# EasyEDA Pro project ProPrj_两相交错电源demo_2025-05-26.epro, schematic Schematic1_1
Board Name: Board1; Create Date: 2025-03-06; Page Name: P1; Project Name: 两相交错电源demo; Schematic Name: Schematic1; Update Date: 2025-03-09; Company: 嘉立创EDA; Page Size: A4; Version: V1.0
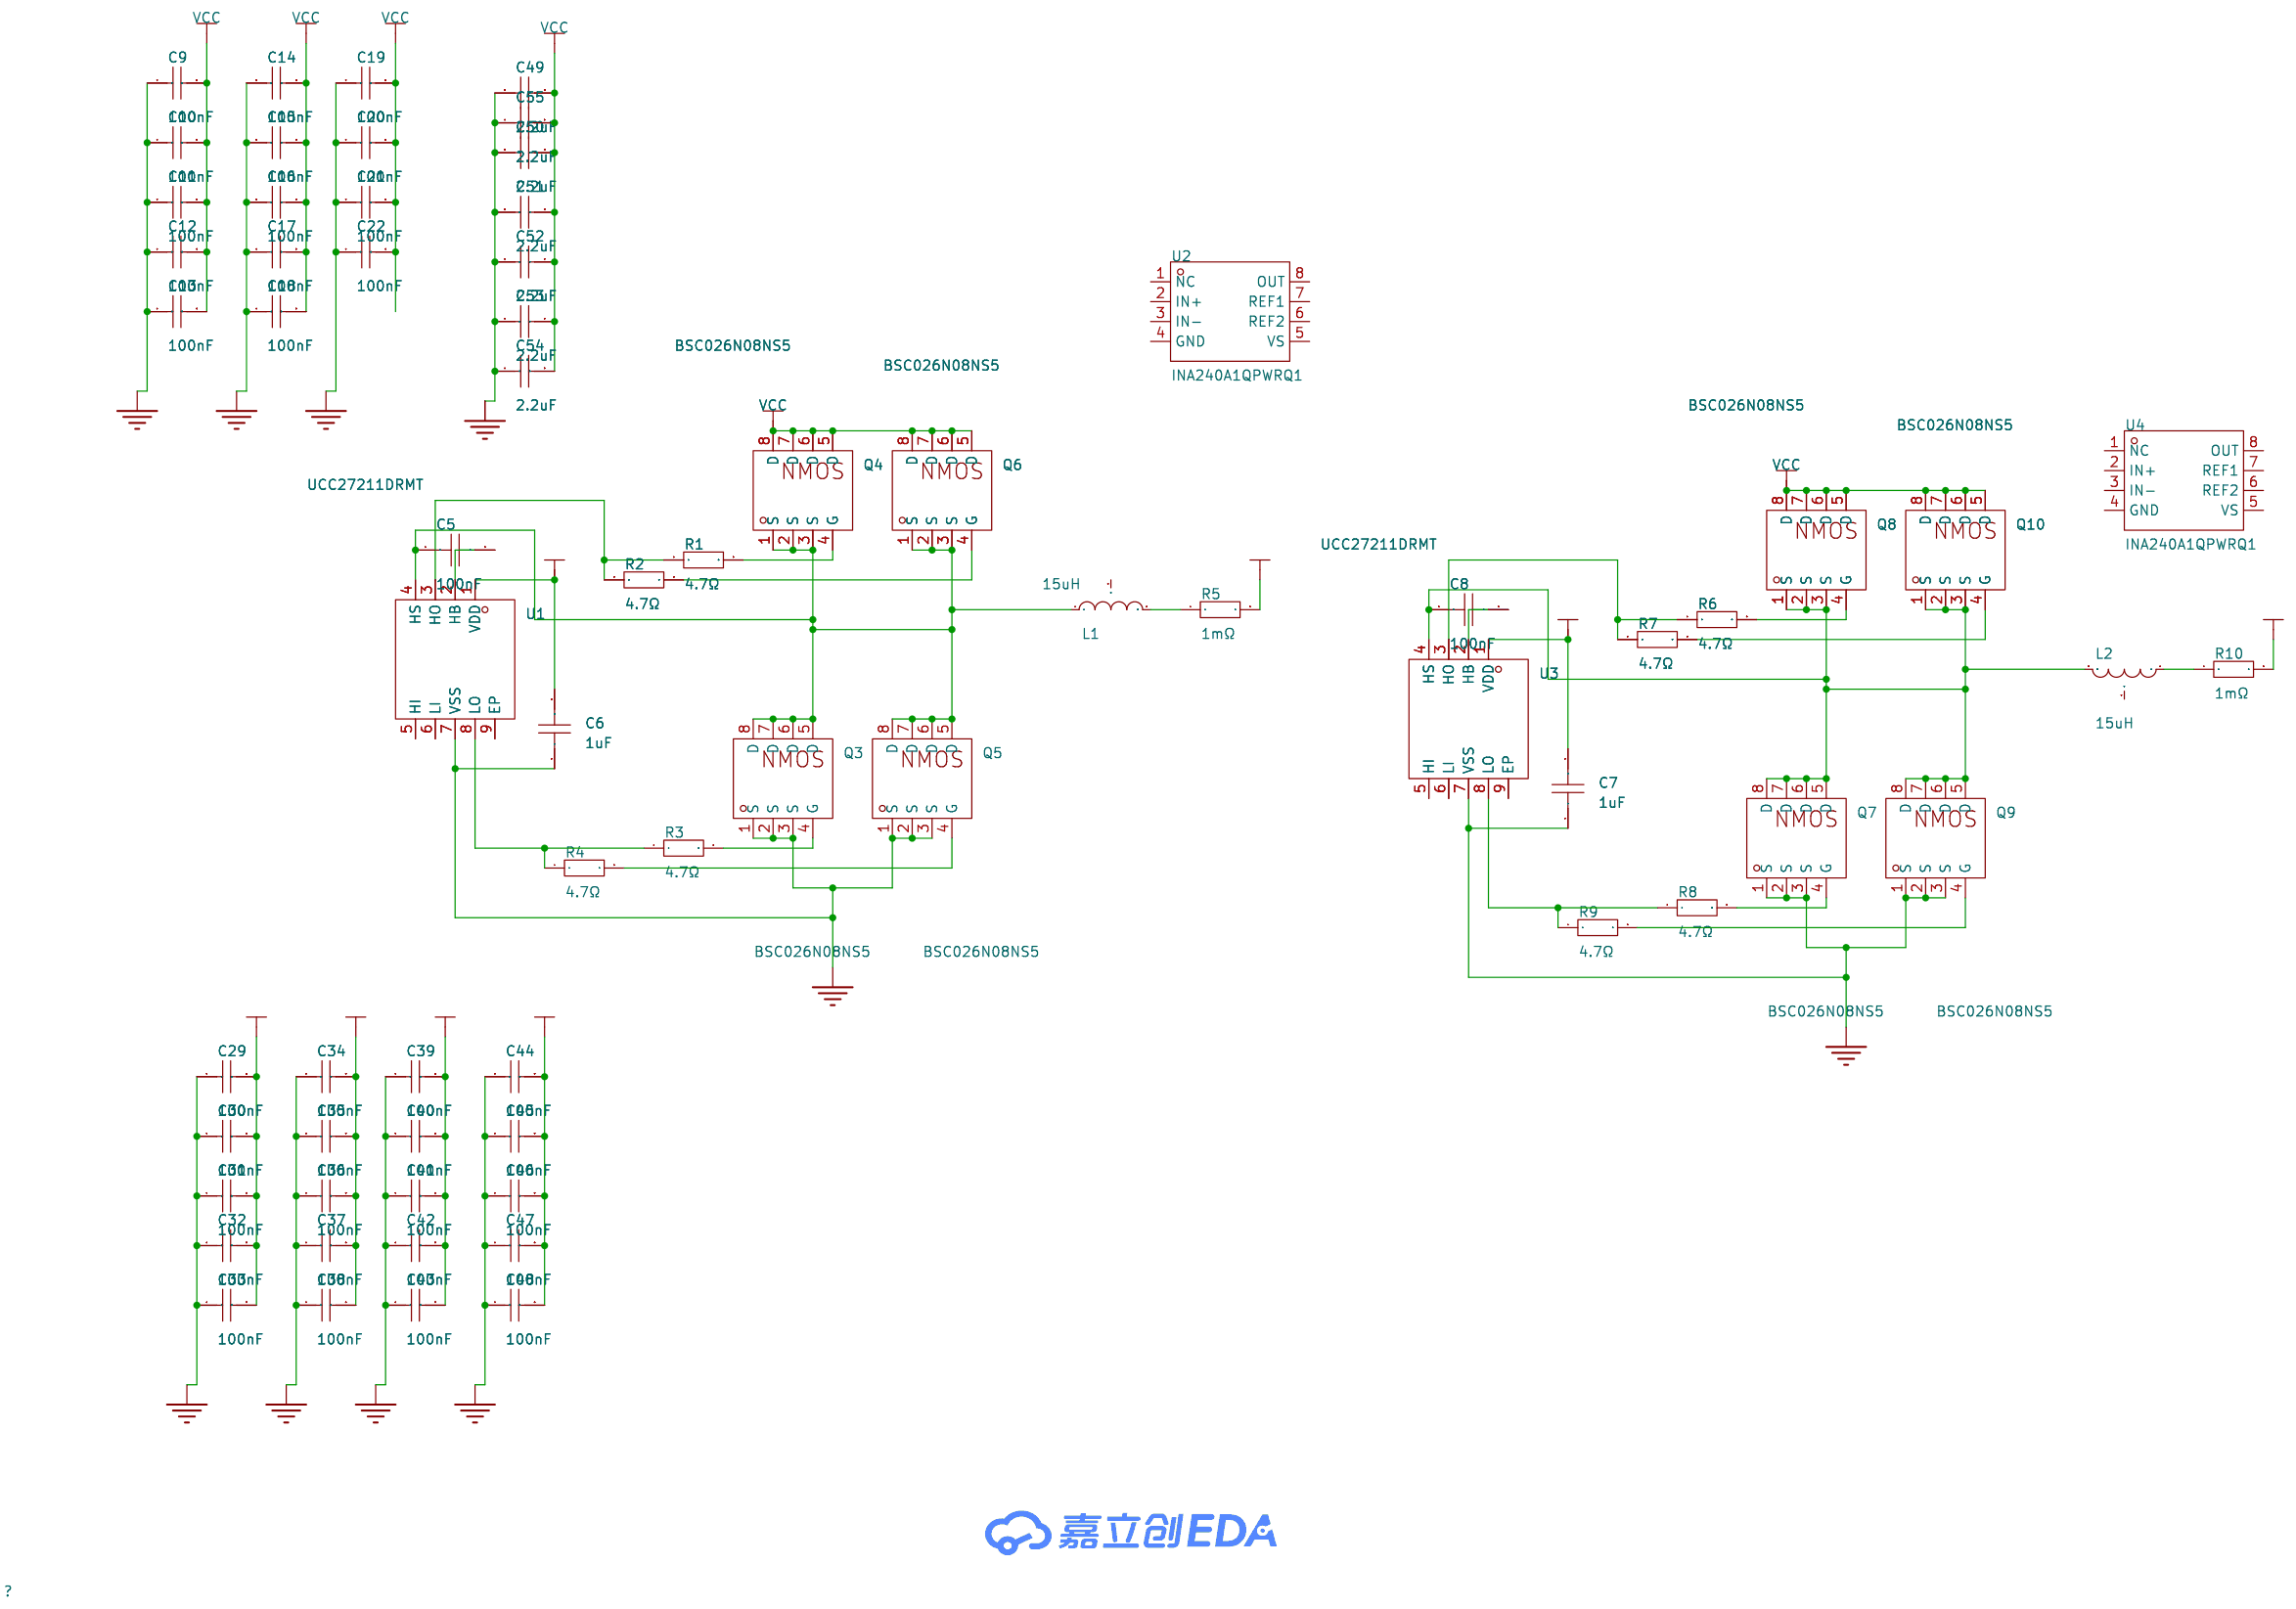
[diagram p3: schematic sheet]

## Parts
C5  100nF  [C0805]
C6  1uF  [C0805]
C7  1uF  [C0805]
C8  100nF  [C0805]
C9  100nF  [C1206]
C10  100nF  [C1206]
C11  100nF  [C1206]
C12  100nF  [C1206]
C13  100nF  [C1206]
C14  100nF  [C1206]
C15  100nF  [C1206]
C16  100nF  [C1206]
C17  100nF  [C1206]
C18  100nF  [C1206]
C19  100nF  [C1206]
C20  100nF  [C1206]
C21  100nF  [C1206]
C22  100nF  [C1206]
C29  100nF  [C1206]
C30  100nF  [C1206]
C31  100nF  [C1206]
C32  100nF  [C1206]
C33  100nF  [C1206]
C34  100nF  [C1206]
C35  100nF  [C1206]
C36  100nF  [C1206]
C37  100nF  [C1206]
C38  100nF  [C1206]
C39  100nF  [C1206]
C40  100nF  [C1206]
C41  100nF  [C1206]
C42  100nF  [C1206]
C43  100nF  [C1206]
C44  100nF  [C1206]
C45  100nF  [C1206]
C46  100nF  [C1206]
C47  100nF  [C1206]
C48  100nF  [C1206]
C49  2.2uF  [C0805]
C50  2.2uF  [C0805]
C51  2.2uF  [C0805]
C52  2.2uF  [C0805]
C53  2.2uF  [C0805]
C54  2.2uF  [C0805]
C55  2.2uF  [C0805]
L1  15uH  [IND-SMD_3P-L28.0-W27.0_1]
L2  15uH  [IND-SMD_3P-L28.0-W27.0_1]
Q3  BSC026N08NS5  [PG-TDSON-8_L5.0-W6.0-P1.27-BL-EP]
Q4  BSC026N08NS5  [PG-TDSON-8_L5.0-W6.0-P1.27-BL-EP]
Q5  BSC026N08NS5  [PG-TDSON-8_L5.0-W6.0-P1.27-BL-EP]
Q6  BSC026N08NS5  [PG-TDSON-8_L5.0-W6.0-P1.27-BL-EP]
Q7  BSC026N08NS5  [PG-TDSON-8_L5.0-W6.0-P1.27-BL-EP]
Q8  BSC026N08NS5  [PG-TDSON-8_L5.0-W6.0-P1.27-BL-EP]
Q9  BSC026N08NS5  [PG-TDSON-8_L5.0-W6.0-P1.27-BL-EP]
Q10  BSC026N08NS5  [PG-TDSON-8_L5.0-W6.0-P1.27-BL-EP]
R1  4.7Ω  [R0805]
R2  4.7Ω  [R0805]
R3  4.7Ω  [R0805]
R4  4.7Ω  [R0805]
R5  1mΩ  [R1206]
R6  4.7Ω  [R0805]
R7  4.7Ω  [R0805]
R8  4.7Ω  [R0805]
R9  4.7Ω  [R0805]
R10  1mΩ  [R1206]
U1  UCC27211DRMT  [VSON-8_L4.0-W4.0-BL-EP]
U2  INA240A1QPWRQ1  [TSSOP-8_L4.4-W3.0-P0.65-LS6.4-BL]
U3  UCC27211DRMT  [VSON-8_L4.0-W4.0-BL-EP]
U4  INA240A1QPWRQ1  [TSSOP-8_L4.4-W3.0-P0.65-LS6.4-BL]

## Library data of the parts
C5-C8 = C0805S102K1RAC7800: 容值:1nF;精度:±10%;额定电压:100V;温度系数:X7R;; LCSC Part Name: 1nF ±10% 100V; Supplier Part: C141167; Manufacturer: KEMET(基美); Supplier Footprint: 0805; Datasheet: https://atta.szlcsc.com/upload/public/pdf/source/20171201/C141167_15121177000921156234.pdf; Supplier: LCSC; Tolerance: ±10%; Voltage Rated: 100V; Temperature Coefficient: X7R
C9-C22 C29-C48 = CL31B104KBCNNNC: 容值:100nF;精度:±10%;额定电压:50V;材质(温度系数):X7R;; LCSC Part Name: 100nF ±10% 50V; Supplier Part: C24497; Manufacturer: SAMSUNG(三星); Supplier Footprint: 1206; JLCPCB Part Class: 基础库; Datasheet: https://atta.szlcsc.com/upload/public/pdf/source/20160218/1457707763339.pdf; Supplier: LCSC; Tolerance: ±10%; Voltage Rated: 50V; Temperature Coefficient: X7R
C49-C55 = CGA0805X7R225K101MT: 容值:2.2uF;精度:±10%;额定电压:100V;材质(温度系数):X7R;; LCSC Part Name: 2.2uF ±10% 100V; Supplier Part: C6119935; Manufacturer: HRE(芯声); Supplier Footprint: 0805; JLCPCB Part Class: Extended Part; Datasheet: https://atta.szlcsc.com/upload/public/pdf/source/20240429/FFBBB2C1A6FCA7F2201C7203CC19BC42.pdf; Supplier: LCSC; Tolerance: ±10%; Voltage Rated: 100V; Temperature Coefficient: X7R
L1 L2 = MTP2920-150MC: 电感值:15uH;精度:±20%;额定电流:20A;饱和电流(Isat):20A;; LCSC Part Name: 15uH ±20% 20A; Supplier Part: C2858867; Manufacturer: COILMX(迈翔科技); Supplier Footprint: SMD,28x27x21.5mm; Supplier: LCSC; Tolerance: ±20%; Rated Current: 20A; Saturation Current (Isat): 20A; DC Resistance (DCR): 2.5mΩ
Q3-Q10 = BSC026N08NS5: 类型:-;漏源电压(Vdss):-;连续漏极电流(Id):-;功率(Pd):-;导通电阻(RDS(on)@Vgs,Id):-;阈值电压(Vgs(th)@Id):-;; Supplier Part: C534311; Manufacturer: Infineon(英飞凌); Supplier Footprint: TDSON-8-EP(5x6); JLCPCB Part Class: 扩展库; Datasheet: https://atta.szlcsc.com/upload/public/pdf/source/20210128/C534311_A26F5C2A3F6ED0B8CFCE9EC3167D41E6.pdf; Supplier: LCSC
R1-R4 R6-R9 = 0805W8F470KT5E: 电阻类型:厚膜电阻;阻值:4.7Ω;精度:±1%;功率:125mW;最大工作电压:150V;温度系数:±200ppm/℃;; LCSC Part Name: 4.7Ω ±1% 125mW 厚膜电阻; Supplier Part: C17675; Manufacturer: UNI-ROYAL(厚声); Supplier Footprint: 0805; JLCPCB Part Class: 基础库; Datasheet: https://atta.szlcsc.com/upload/public/pdf/source/20200306/C422600_1E6D84923E4A46A82E41ADD87F860B5C.pdf; Supplier: LCSC; Type: 厚膜电阻; Tolerance: ±1%; Power(Watts): 125mW; Overload Voltage (Max): 150V; Temperature Coefficient: ±200ppm/℃; Operating Temperature Range: -55℃~+155℃
R5 R10 = FRM121WJR001TM: 电阻类型:采样电阻;阻值:1mΩ;精度:±5%;功率:1W;温度系数:±50ppm/℃;; LCSC Part Name: 1mΩ ±5% 1W 合金电阻; Supplier Part: C7419993; Manufacturer: FOJAN(富捷); Supplier Footprint: 1206; JLCPCB Part Class: Extended Part; Datasheet: https://atta.szlcsc.com/upload/public/pdf/source/20240709/7FCE84187288C94C67B1004F90EDDF14.pdf; Supplier: LCSC; Type: 采样电阻; Tolerance: ±5%; Power(Watts): 1W; Temperature Coefficient: ±50ppm/℃
U1 U3 = UCC27211DRMT: 驱动配置:半桥;负载类型:MOSFET;驱动通道数:2;峰值灌电流:4A;峰值拉电流:4A;电源电压:8V~17V;上升时间:7.2ns;下降时间:5.5ns;; Supplier Part: C181442; Manufacturer: TI(德州仪器); Supplier Footprint: VSON-8(4x4); JLCPCB Part Class: 扩展库; Datasheet: https://www.ti.com/cn/lit/gpn/ucc27211; Supplier: LCSC; Driven Configuration: 半桥; Load Type: MOSFET; Number of Drivers: 2; Peak Output Current(sink): 4A; Peak Output Current(source): 4A; Supply Voltage: 8V~17V; Rise Time: 7.2ns; Fall Time: 5.5ns; Operating Temperature: -40℃~+140℃@(Tj)
U2 U4 = INA240A1QPWRQ1: 放大器数:单路;; Supplier Part: C553123; Manufacturer: TI(德州仪器); Supplier Footprint: TSSOP-8; JLCPCB Part Class: 扩展库; Datasheet: https://www.ti.com/cn/lit/gpn/ina240-q1; Supplier: LCSC; Number of Channels: 单路; Supply Current: 1.8mA; Operating Temperature: -40℃~+125℃

## Nets
12V: C6.2 C7.2 U1.1(VDD) U3.1(VDD)
GND: C6.1 C7.1 C9.1 C10.1 C11.1 C12.1 C13.1 C14.1 C15.1 C16.1 C17.1 C18.1 C19.1 C20.1 C21.1 C22.1 C29.1 C30.1 C31.1 C32.1 C33.1 C34.1 C35.1 C36.1 C37.1 C38.1 C39.1 C40.1 C41.1 C42.1 C43.1 C44.1 C45.1 C46.1 C47.1 C48.1 C49.1 C50.1 C51.1 C52.1 C53.1 C54.1 C55.1 Q3.1(S) Q3.2(S) Q3.3(S) Q5.1(S) Q5.2(S) Q5.3(S) Q7.1(S) Q7.2(S) Q7.3(S) Q9.1(S) Q9.2(S) Q9.3(S) U1.7(VSS) U3.7(VSS)
VCC: C9.2 C10.2 C11.2 C12.2 C13.2 C14.2 C15.2 C16.2 C17.2 C18.2 C19.2 C20.2 C21.2 C22.2 C49.2 C50.2 C51.2 C52.2 C53.2 C54.2 C55.2 Q4.5(D) Q4.6(D) Q4.7(D) Q4.8(D) Q6.5(D) Q6.6(D) Q6.7(D) Q6.8(D) Q8.5(D) Q8.6(D) Q8.7(D) Q8.8(D) Q10.5(D) Q10.6(D) Q10.7(D) Q10.8(D)
VOUT: C29.2 C30.2 C31.2 C32.2 C33.2 C34.2 C35.2 C36.2 C37.2 C38.2 C39.2 C40.2 C41.2 C42.2 C43.2 C44.2 C45.2 C46.2 C47.2 C48.2 R5.2 R10.2
$1N511: C5.1 L1.1 Q3.5(D) Q3.6(D) Q3.7(D) Q3.8(D) Q4.1(S) Q4.2(S) Q4.3(S) Q5.5(D) Q5.6(D) Q5.7(D) Q5.8(D) Q6.1(S) Q6.2(S) Q6.3(S) U1.4(HS)
$1N1045: Q4.4(G) R1.2
$1N1092: Q6.4(G) R2.2
$1N1097: R1.1 R2.1 U1.3(HO)
$1N1189: Q5.4(G) R4.2
$1N1192: Q3.4(G) R3.2
$1N1197: R3.1 R4.1 U1.8(LO)
$1N1401: L1.2 R5.1
$1N1500: C5.2 U1.2(HB)
$1N2649: Q9.4(G) R9.2
$1N2651: L2.1 R10.1
$1N2653: C8.1 L2.2 Q7.5(D) Q7.6(D) Q7.7(D) Q7.8(D) Q8.1(S) Q8.2(S) Q8.3(S) Q9.5(D) Q9.6(D) Q9.7(D) Q9.8(D) Q10.1(S) Q10.2(S) Q10.3(S) U3.4(HS)
$1N2654: Q10.4(G) R7.2
$1N2655: Q7.4(G) R8.2
$1N2657: R6.1 R7.1 U3.3(HO)
$1N2658: C8.2 U3.2(HB)
$1N2659: R8.1 R9.1 U3.8(LO)
$1N2660: Q8.4(G) R6.2

Not connected (* = marked no-connect by the designer): L1 3; L2 3; U1 5(HI) 6(LI) 9(EP); U2 1(NC) 2(IN+) 3(IN-) 4(GND) 5(VS) 6(REF2) 7(REF1) 8(OUT); U3 5(HI) 6(LI) 9(EP); U4 1(NC) 2(IN+) 3(IN-) 4(GND) 5(VS) 6(REF2) 7(REF1) 8(OUT)
